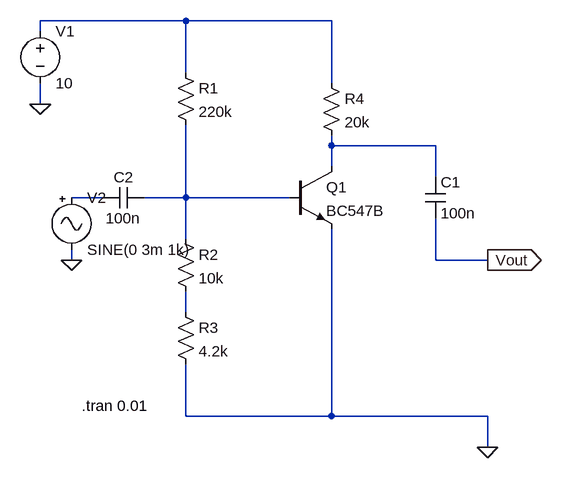
[diagram p0: schematic Draft16.asc]
Draft16.asc, the LTspice schematic file:
Version 4
SHEET 1 880 680
WIRE 304 0 80 0
WIRE 528 0 304 0
WIRE 80 16 80 0
WIRE 304 80 304 0
WIRE 528 96 528 0
WIRE 80 128 80 96
WIRE 528 192 528 176
WIRE 688 192 528 192
WIRE 528 224 528 192
WIRE 688 240 688 192
WIRE 176 272 128 272
WIRE 304 272 304 160
WIRE 304 272 240 272
WIRE 464 272 304 272
WIRE 304 336 304 272
WIRE 128 368 128 352
WIRE 688 368 688 304
WIRE 768 368 688 368
WIRE 304 448 304 416
WIRE 304 608 304 528
WIRE 528 608 528 320
WIRE 528 608 304 608
WIRE 768 608 528 608
WIRE 768 656 768 608
FLAG 80 128 0
FLAG 768 656 0
FLAG 128 368 0
FLAG 768 368 Vout
IOPIN 768 368 Out
SYMBOL res 288 64 R0
SYMATTR InstName R1
SYMATTR Value 220k
SYMBOL res 288 320 R0
SYMATTR InstName R2
SYMATTR Value 10k
SYMBOL res 288 432 R0
SYMATTR InstName R3
SYMATTR Value 4.2k
SYMBOL res 512 80 R0
SYMATTR InstName R4
SYMATTR Value 20k
SYMBOL npn 464 224 R0
SYMATTR InstName Q1
SYMATTR Value BC547B
SYMBOL cap 672 240 R0
SYMATTR InstName C1
SYMATTR Value 100n
SYMBOL cap 240 256 R90
WINDOW 0 0 32 VBottom 2
WINDOW 3 32 32 VTop 2
SYMATTR InstName C2
SYMATTR Value 100n
SYMBOL voltage 80 0 R0
SYMATTR InstName V1
SYMATTR Value 10
SYMBOL Misc/signal 128 256 R0
SYMATTR InstName V2
SYMATTR Value SINE(0 3m 1k)
TEXT 144 592 Left 2 !.tran 0.01

The netlist it stands for:
* Draft16.asc
R1 N001 N004 220k
R2 N004 N005 10k
R3 N005 0 4.2k
R4 N001 N002 20k
Q1 N002 N004 0 0 BC547B
C1 N002 Vout 100n
C2 N004 N003 100n
V1 N001 0 10
V2 N003 0 SINE(0 3m 1k)
.model NPN NPN
.model PNP PNP
.lib standard.bjt
.tran 0.01
.backanno
.end